# EAGLE design LoginNFC (EAGLE 7.5.0)
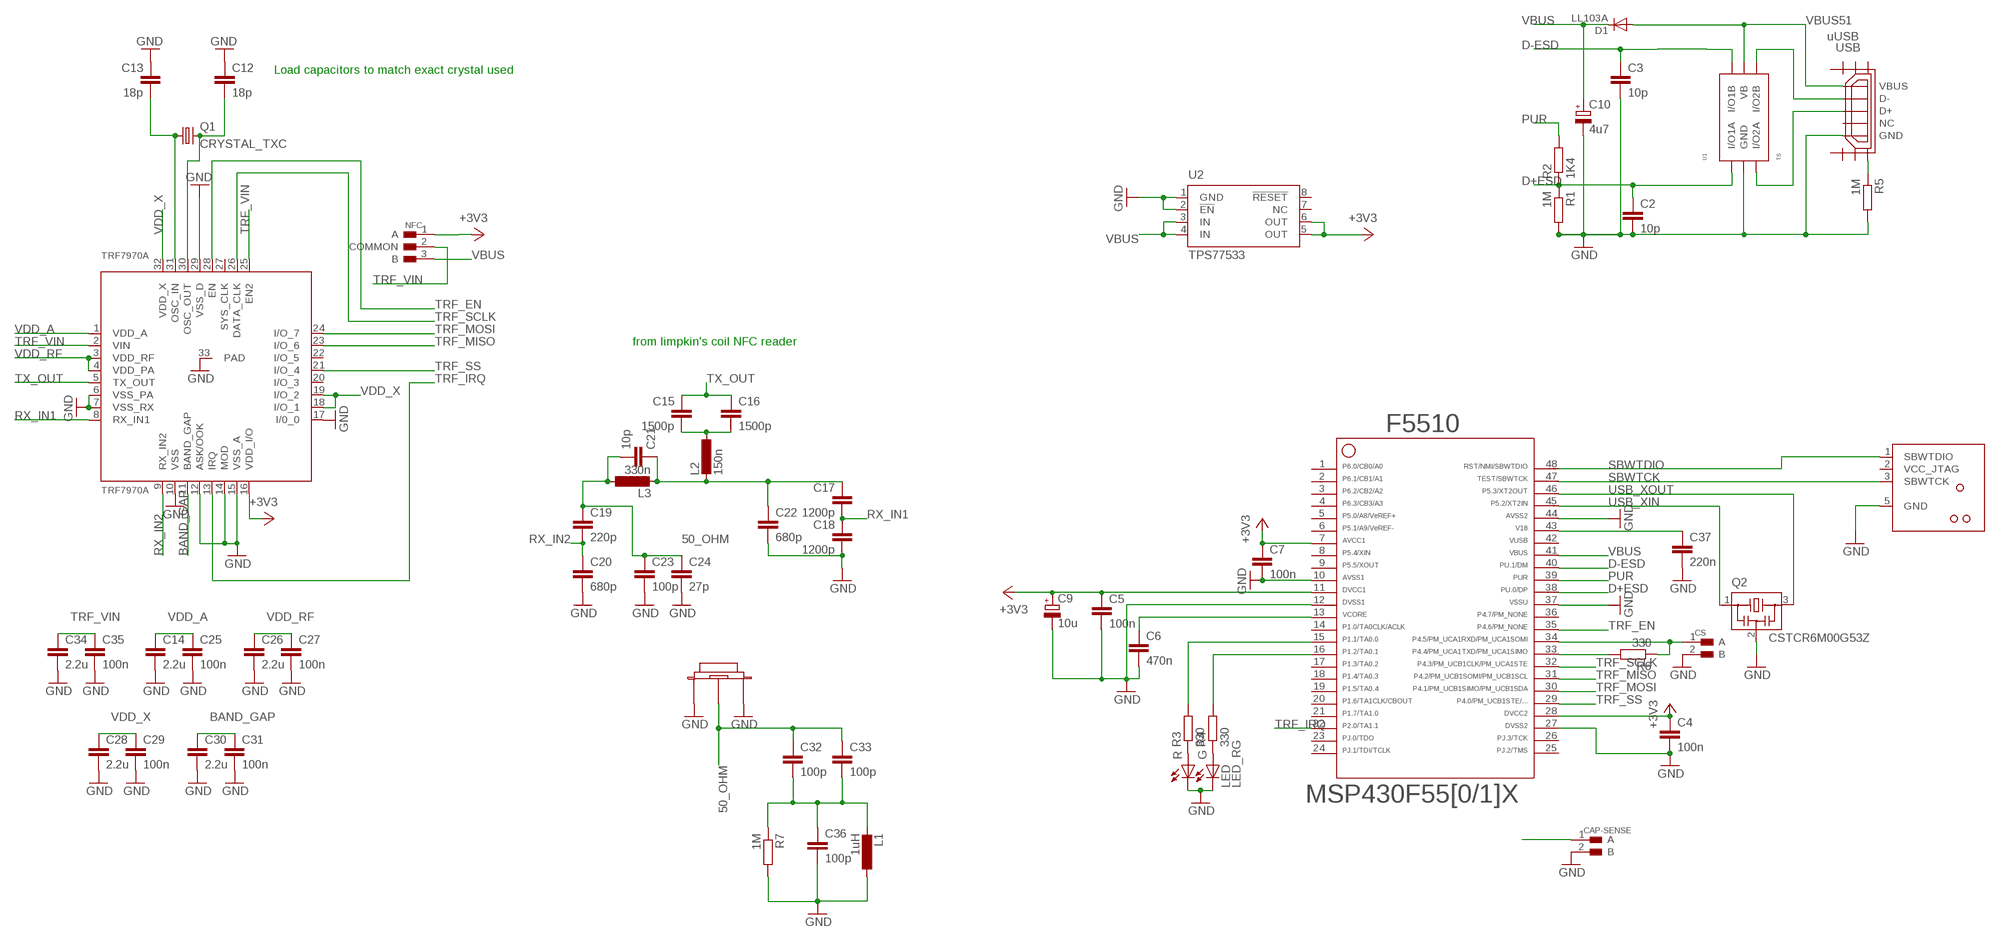
[diagram p0: schematic, sheet 1]

## Parts
C2  10p  C-EUC0805  [C0805]
C3  10p  C-EUC0805  [C0805]
C4  100n  C-EUC0805  [C0805]
C5  100n  C-EUC0805  [C0805]
C6  470n  C-EUC0805  [C0805]
C7  100n  C-EUC0805  [C0805]
C9  10u  CPOL-EUA/3216-18R  [A/3216-18R]
C10  4u7  CPOL-EUA/3216-18R  [A/3216-18R]
C12  18p  C-EU_C0805  [C0805]
C13  18p  C-EU_C0805  [C0805]
C14  2.2u  C-EU_C0805  [C0805]
C15  1500p  C-EUC0805  [C0805]
C16  1500p  C-EUC0805  [C0805]
C17  1200p  C-EUC0805  [C0805]
C18  1200p  C-EUC0805  [C0805]
C19  220p  C-EUC0805  [C0805]
C20  680p  C-EUC0805  [C0805]
C21  10p  C-EUC0805  [C0805]
C22  680p  C-EUC0805  [C0805]
C23  100p  C-EUC0805  [C0805]
C24  27p  C-EUC0805  [C0805]
C25  100n  C-EU_C0805  [C0805]
C26  2.2u  C-EU_C0805  [C0805]
C27  100n  C-EU_C0805  [C0805]
C28  2.2u  C-EU_C0805  [C0805]
C29  100n  C-EU_C0805  [C0805]
C30  2.2u  C-EU_C0805  [C0805]
C31  100n  C-EU_C0805  [C0805]
C32  100p  C-EUC0805  [C0805]
C33  100p  C-EUC0805  [C0805]
C34  2.2u  C-EU_C0805  [C0805]
C35  100n  C-EU_C0805  [C0805]
C36  100p  C-EUC0805  [C0805]
C37  220n  C-EUC0805  [C0805]
CAP-SENSE  PAD  [JUMP-2]
CS  PAD  [JUMP-2]
D1  LL103A  DIODE  [SOD-80]
F5510  F55[0/1]X---PT48  [PT48]
JTAG  TC2030-MSP430-NO-UART-NL  [TC2030-MSP430-NL-NO-UART]
L1  1uH  L-EU_MIDMOUNT  [RADIAL_MIDMOUNT_5]
L2  150n  L-EU_L1008  [L1008]
L3  330n  L-EU_L1008  [L1008]
LED  LED_RG  [1411]
NFC  JUMPER  [SMT-JUMPER]
Q1  CRYSTAL_TXC  [CRYSTAL_TCX]
Q2  CSTCR6M00G53Z  [CSTCR6M]
R1  1M  R-EU_R0805  [R0805]
R2  1K4  R-EU_R0805  [R0805]
R3  330  R-EU_R0805  [R0805]
R4  330  R-EU_R0805  [R0805]
R5  1M  R-EU_R0805  [R0805]
R6  330  R-EU_R0805  [R0805]
R7  1M  R-EU_R0805  [R0805]
TRF7970A  TRF7970A  [QFN(RHB)32]
U1  TS  IP4234CZ6SOT-457  [SOT-457]
U2  TPS77533  [SO08]
UFL1  U.FL  [U.FL]
USB  uUSB  USB_MICRO_FLIPPED  [HIROSE-ZX62R-B-5P]

## Nets
50_OHM: C19.1 C21.2 C23.1 C24.1 C32.1 C33.1 L3.1 UFL1.RF
+3V3: C4.1 C5.1 C7.1 C9.+ F5510.7 F5510.11 F5510.28 NFC.1(A) TRF7970A.16(VDD_I/O) U2.5(OUT) U2.6(OUT)
BAND_GAP: C30.1 C31.1 TRF7970A.11(BAND_GAP)
D+ESD: C2.1 F5510.38 R1.1 R2.1 U1.1(I/O1A)
D-ESD: C3.1 F5510.40 U1.6(I/O1B)
GND: C2.2 C3.2 C4.2 C5.2 C6.2 C7.2 C9.- C10.- C12.1 C13.1 C14.2 C18.2 C20.2 C22.2 C23.2 C24.2 C25.2 C26.2 C27.2 C28.2 C29.2 C30.2 C31.2 C34.2 C35.2 C36.2 C37.2 CAP-SENSE.2(B) CS.2(B) F5510.10 F5510.12 F5510.27 F5510.37 F5510.44 JTAG.5(GND) L1.P$1 LED.P$3(RED_C) LED.P$4(GREEN_C) Q2.2 R1.2 R5.2 R7.2 TRF7970A.6(VSS_PA) TRF7970A.7(VSS_RX) TRF7970A.10(VSS) TRF7970A.12(ASK/OOK) TRF7970A.14(MOD) TRF7970A.15(VSS_A) TRF7970A.17(I/0_0) TRF7970A.29(VSS_D) TRF7970A.33(PAD) U1.2(GND) U2.1(GND) U2.2(!EN) UFL1.GND1 UFL1.GND2 USB.GND
LED_G: F5510.16 R4.2
LED_R: F5510.15 R3.2
N$1: U1.3(I/O2A) USB.D+
N$2: U1.4(I/O2B) USB.D-
N$3: C6.1 F5510.13
N$4: LED.P$1(RED_A) R3.1
N$5: LED.P$2(GREEN_A) R4.1
N$6: C32.2 C33.2 C36.1 L1.P$2 R7.1
N$7: R5.1 USB.SHIELD3
N$8: C15.2 C16.2 L2.1
N$9: C17.1 C21.1 C22.1 L2.2 L3.2
N$10: CS.1(A) F5510.34 R6.1
N$12: C13.2 Q1.1 TRF7970A.31(OSC_IN)
N$13: C12.2 Q1.2 TRF7970A.30(OSC_OUT)
N$14: F5510.33 R6.2
N$16: CAP-SENSE.1(A)
PUR: F5510.39 R2.2
RX_IN1: C17.2 C18.1 TRF7970A.8(RX_IN1)
RX_IN2: C19.2 C20.1 TRF7970A.9(RX_IN2)
SBWTCK: F5510.47 JTAG.3(SBWTCK)
SBWTDIO: F5510.48 JTAG.1(SBWTDIO)
TRF_EN: F5510.35 TRF7970A.28(EN)
TRF_IRQ: F5510.22 TRF7970A.13(IRQ)
TRF_MISO: F5510.31 TRF7970A.23(I/O_6)
TRF_MOSI: F5510.30 TRF7970A.24(I/O_7)
TRF_SCLK: F5510.32 TRF7970A.26(DATA_CLK)
TRF_SS: F5510.29 TRF7970A.21(I/O_4)
TRF_VIN: C34.1 C35.1 NFC.2(COMMON) TRF7970A.2(VIN) TRF7970A.25(EN2)
TX_OUT: C15.1 C16.1 TRF7970A.5(TX_OUT)
USB_XIN: F5510.45 Q2.1
USB_XOUT: F5510.46 Q2.3
V18: C37.1 F5510.43
VBUS: C10.+ D1.2(K) F5510.41 NFC.3(B) U2.3(IN) U2.4(IN)
VBUS51: D1.1(A) U1.5(VB) USB.VBUS
VDD_A: C14.1 C25.1 TRF7970A.1(VDD_A)
VDD_RF: C26.1 C27.1 TRF7970A.3(VDD_RF) TRF7970A.4(VDD_PA)
VDD_X: C28.1 C29.1 TRF7970A.18(I/O_1) TRF7970A.19(I/O_2) TRF7970A.32(VDD_X)
Unconnected: F5510.1 F5510.2 F5510.3 F5510.4 F5510.5 F5510.6 F5510.8 F5510.9 F5510.14 F5510.17 F5510.18 F5510.19 F5510.20 F5510.21 F5510.23 F5510.24 F5510.25 F5510.26 F5510.36 TRF7970A.20(I/O_3) TRF7970A.22(I/O_5) TRF7970A.27(SYS_CLK) U2.7(NC) U2.8(!RESET) USB.NC USB.SHIELD1 USB.SHIELD2 USB.SHIELD4 USB.SHIELD5 USB.SHIELD6

## Notes on the sheet
- Load capacitors to match exact crystal used
- from limpkin's coil NFC reader

## Power pins joined to a net without a drawn wire
42: F5510.42
VCC_JTAG: JTAG.2(VCC_JTAG)

## Library data of the parts
C2-C7 C15-C24 C32 C33 C36 C37 = FredMiscellaneous:C-EU: CAPACITOR, European symbol
C9 C10 = rcl:CPOL-EU: POLARIZED CAPACITOR, European symbol
C12-C14 C25-C31 C34 C35 = FredMiscellaneous:C-EU_: CAPACITOR, European symbol
CAP-SENSE CS = 0xfred:PAD
D1 = 0xfred:DIODE
F5510 = TI_MSP430_v16:F55[0/1]X---PT48: ***F55[0/1/2]X*** PT48 Rev. 1.0 06/2010 "http://www.ti.com/lit/gpn/msp430f5509" Only for FF5504, F5508,F5509,F5510
JTAG = tag-connect:TC2030-MSP430-NO-UART
L1-L3 = FredMiscellaneous:L-EU_: INDUCTOR, European symbol
LED = 0xfred:LED_RG: Wurth bi-color LED 1411
NFC = FredMiscellaneous:JUMPER
Q1 = crystal_txc:CRYSTAL_TXC: TXC - 7A-16.000MAAJ-T - XTAL, 16.000MHZ, 18PF, SMD, 5.0X3.2
Q2 = murata-filter:CSTCR: Resonator Source: murata.co.jp; MPN: CSTCR6M00G53-R0; OC_FARNELL: 1170434; OC_NEWARK: 25M8759
R1-R7 = FredMiscellaneous:R-EU_: RESISTOR, European symbol
TRF7970A = FredMiscellaneous:TRF7970A: TRF7970ARHB
U1 = PP_Passives:IP4234CZ6: Mouser Part #: 771-IP4234CZ6125 Manufacturer Part #: IP4234CZ6,125 Manufacturer: NXP Semiconductors Description: ESD Suppressors Single USB 2.0 ESD Protection 6-Pin http://www.mouser.com/ProductDetail/NXP-Semiconductors/IP4234CZ6125/?qs=sGAEpiMZZMvxHShE6Whpu7QUdHOfUl1T0xbl582qhFk%3d
U2 = 0xfred:TPS77533
UFL1 = FredMiscellaneous:U.FL
USB = FredMiscellaneous:USB_MICRO_FLIPPED

## Board
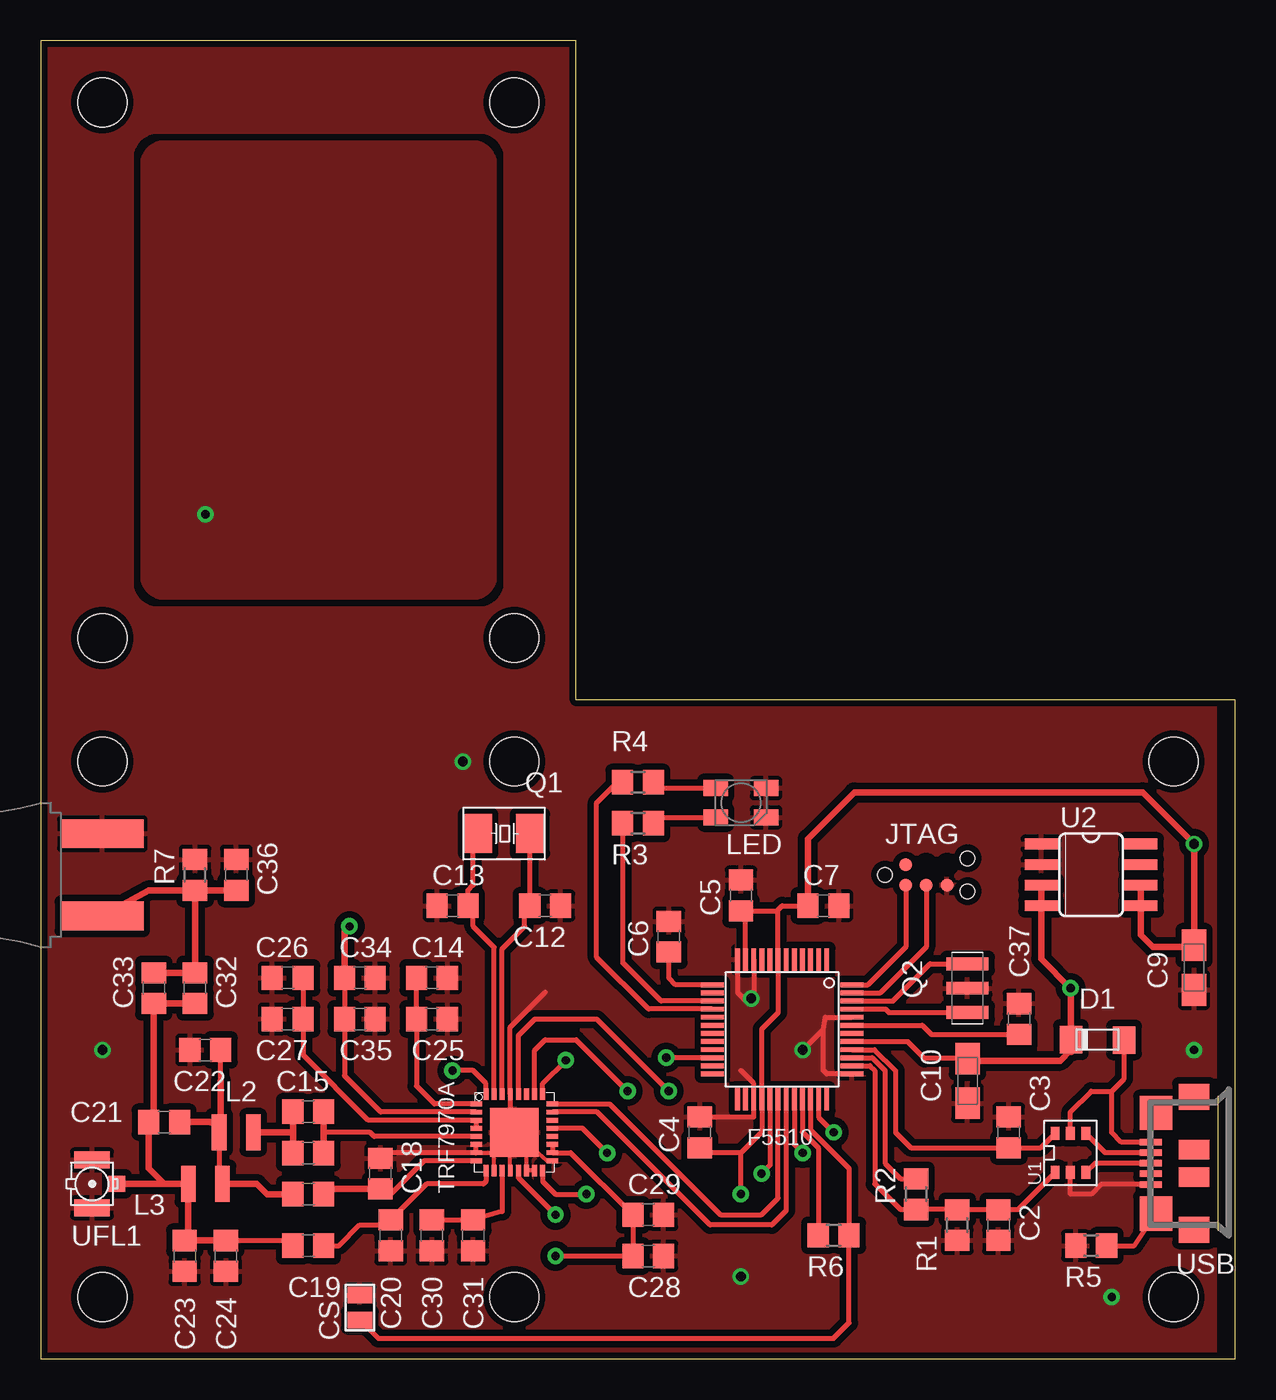
[diagram p1: board, top side]
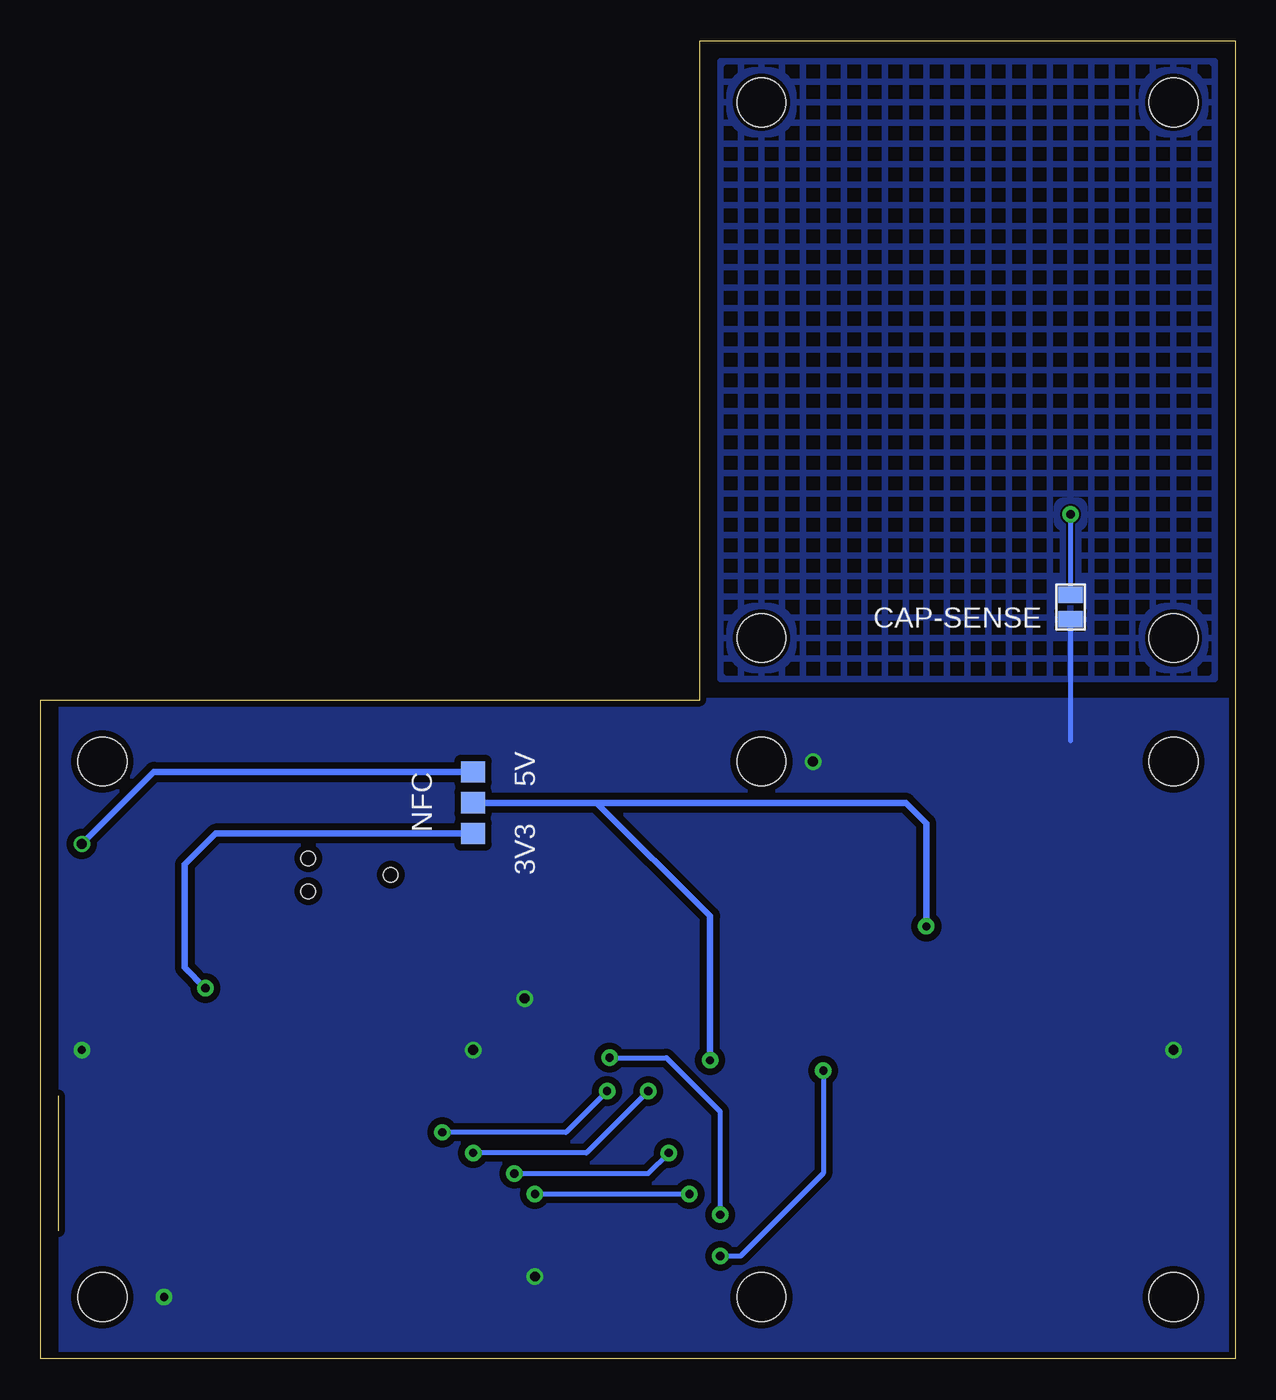
[diagram p2: board, bottom side, seen from below]

Size 73.66 x 81.28 mm. Coordinates in mm from the lower left corner, seen from the top.
Outline: 0,0 73.66,0 73.66,40.64 33.02,40.64 33.02,81.28 0,81.28 0,0
Copper layers (1*16): Top 0.035mm / dielectric 1.5mm / Bottom 0.035mm
Design rules "dirt_cheap_dirty_boards.v1": minimum track width 5mil, minimum drill 12mil, track to track 5mil, track to pad 5mil, pad to pad 5mil, via to via 5mil, smd to smd 0mil, copper to edge 10mil, drill to drill 10mil, minimum pad ring 10mil, minimum via ring 6mil, stop-mask expansion 2mil, vias tented up to drill 25mil, thermal gap 10mil
Holes 3 mm at 3.81,3.81 69.85,3.81 69.85,36.83 3.81,36.83 29.21,3.81 29.21,36.83 29.21,44.45 3.81,44.45 3.81,77.47 29.21,77.47

### Footprints (pad centres in the part's own frame; a part is rotated, then mirrored left to right if it is on the bottom)
C0805 = smd 1.3 x 1.5: 1 -0.95,0; 2 0.95,0
A/3216-18R = smd 1.95 x 1.5: + 1.375,0; - -1.375,0
JUMP-2 = smd 1.016 x 1.524: 1 -0.762,0; 2 0.762,0
SOD-80 = smd 1.397 x 1.702: 1 1.397,-0.025; 2 -1.88,0
PT48 = smd 1.4 x 0.3: 1 -4.3,2.75; 2 -4.3,2.25; 3 -4.3,1.75; 4 -4.3,1.25; 5 -4.3,0.75; 6 -4.3,0.25; 7 -4.3,-0.25; 8 -4.3,-0.75; 9 -4.3,-1.25; 10 -4.3,-1.75; 11 -4.3,-2.25; 12 -4.3,-2.75; 25 4.3,-2.75; 26 4.3,-2.25; 27 4.3,-1.75; 28 4.3,-1.25; 29 4.3,-0.75; 30 4.3,-0.25; 31 4.3,0.25; 32 4.3,0.75; 33 4.3,1.25; 34 4.3,1.75; 35 4.3,2.25; 36 4.3,2.75 | smd 0.3 x 1.4: 13 -2.75,-4.3; 14 -2.25,-4.3; 15 -1.75,-4.3; 16 -1.25,-4.3; 17 -0.75,-4.3; 18 -0.25,-4.3; 19 0.25,-4.3; 20 0.75,-4.3; 21 1.25,-4.3; 22 1.75,-4.3; 23 2.25,-4.3; 24 2.75,-4.3; 37 2.75,4.3; 38 2.25,4.3; 39 1.75,4.3; 40 1.25,4.3; 41 0.75,4.3; 42 0.25,4.3; 43 -0.25,4.3; 44 -0.75,4.3; 45 -1.25,4.3; 46 -1.75,4.3; 47 -2.25,4.3; 48 -2.75,4.3
TC2030-MSP430-NL-NO-UART = smd 0.787 x 0.787: 1 1.27,-0.635; 2 1.27,0.635; 3 2.54,-0.635; 5 3.81,-0.635 | hole 0.889: 0,0; 5.08,-1.016; 5.08,1.016
RADIAL_MIDMOUNT_5 = smd 5.08 x 1.778: P$1 2.54,2.54; P$2 2.54,-2.54
L1008 = smd 0.9 x 2.2: 1 -1.05,0; 2 1.05,0
1411 = smd 1.499 x 0.991: P$1 1.549,0.899; P$2 1.549,-0.899; P$3 -1.549,0.899; P$4 -1.549,-0.899
SMT-JUMPER = smd 1.3 x 1.5: 1 -1.903,0; 2 -0.003,0; 3 1.903,0
CRYSTAL_TCX = smd 1.7 x 2.4: 1 -1.6,0; 2 1.6,0
CSTCR6M = smd 0.8 x 2.6: 1 -1.5,0; 2 0,0; 3 1.5,0
R0805 = smd 1.3 x 1.5: 1 -0.95,0; 2 0.95,0
QFN(RHB)32 = smd 0.7 x 0.3: 1 -2.35,1.75; 2 -2.35,1.25; 3 -2.35,0.75; 4 -2.35,0.25; 5 -2.35,-0.25; 6 -2.35,-0.75; 7 -2.35,-1.25; 8 -2.35,-1.75; 17 2.35,-1.75; 18 2.35,-1.25; 19 2.35,-0.75; 20 2.35,-0.25; 21 2.35,0.25; 22 2.35,0.75; 23 2.35,1.25; 24 2.35,1.75 | smd 0.3 x 0.7: 9 -1.75,-2.35; 10 -1.25,-2.35; 11 -0.75,-2.35; 12 -0.25,-2.35; 13 0.25,-2.35; 14 0.75,-2.35; 15 1.25,-2.35; 16 1.75,-2.35; 25 1.75,2.35; 26 1.25,2.35; 27 0.75,2.35; 28 0.25,2.35; 29 -0.25,2.35; 30 -0.75,2.35; 31 -1.25,2.35; 32 -1.75,2.35 | smd 3 x 3: 33 0,0
SOT-457 = smd 0.8 x 0.55: 1 -1.2,0.95; 2 -1.2,0; 3 -1.2,-0.95; 4 1.2,-0.95; 5 1.2,0; 6 1.2,0.95
SO08 = smd 0.66 x 2.032: 1 -1.905,-3.073; 2 -0.635,-3.073; 3 0.635,-3.073; 4 1.905,-3.073; 5 1.905,3.073; 6 0.635,3.073; 7 -0.635,3.073; 8 -1.905,3.073
U.FL = smd 1.05 x 2.2: GND1 -1.475,0; GND2 1.475,0 | smd 1 x 1.05: RF 0,-1.525
HIROSE-ZX62R-B-5P = smd 1.35 x 0.4: D+ 2.675,0; D- 2.675,-0.65; GND 2.675,1.3; NC 2.675,0.65; VBUS 2.675,-1.3 | smd 1.9 x 1.6: SHIELD1 0,4.1; SHIELD2 0,-4.1 | smd 2 x 2.1: SHIELD3 2.35,3.1; SHIELD4 2.35,-3.1 | smd 1.9 x 1.2: SHIELD5 0,0.85; SHIELD6 0,-0.85

### Placement (x,y rotation side)
C2  59.05,8.26 270 top
C3  59.69,13.97 90 top
C4  40.64,13.97 90 top
C5  43.18,28.57 90 top
C6  38.73,26.04 90 top
C7  48.26,27.94 0 top
C9  71.12,24.13 90 top
C10  57.15,17.14 90 top
C12  31.11,27.94 180 top
C13  25.4,27.94 0 top
C14  24.13,23.5 0 top
C15  16.51,15.24 180 top
C16  16.51,12.7 180 top
C17  16.51,10.16 0 top
C18  20.95,11.43 90 top
C19  16.51,6.99 0 top
C20  21.59,7.62 270 top
C21  7.62,14.61 180 top
C22  10.16,19.05 180 top
C23  8.89,6.35 270 top
C24  11.43,6.35 270 top
C25  24.13,20.95 0 top
C26  15.24,23.5 180 top
C27  15.24,20.95 180 top
C28  37.47,6.35 0 top
C29  37.47,8.89 0 top
C30  24.13,7.62 270 top
C31  26.67,7.62 270 top
C32  9.53,22.86 90 top
C33  6.99,22.86 90 top
C34  19.68,23.5 0 top
C35  19.68,20.95 0 top
C36  12.06,29.84 90 top
C37  60.33,20.95 90 top
CAP-SENSE  10.16,46.35 270 bottom
CS  19.68,3.17 90 top
D1  65.41,19.68 0 top
F5510  45.72,20.32 270 top
JTAG  52.07,29.84 0 top
L1  1.27,29.84 0 top
L2  12.06,13.97 180 top
L3  10.16,10.79 0 top
LED  43.18,34.29 180 top
NFC  46.99,34.29 270 bottom
Q1  28.57,32.38 0 top
Q2  57.15,22.86 90 top
R1  56.52,8.26 270 top
R2  53.98,10.16 90 top
R3  36.83,33.02 180 top
R4  36.83,35.56 180 top
R5  64.77,6.99 180 top
R6  48.9,7.62 180 top
R7  9.53,29.84 90 top
TRF7970A  29.21,13.97 0 top
U1  63.5,12.7 90 top
U2  64.77,29.84 270 top
UFL1  3.17,10.79 90 top
USB  71.12,12.06 180 top

### Tracks (layer width: path | path; a pad name or v marks a point on that pad's centre or on a via)
50_OHM
  Top 0.305: 9.11,7.52 C23.1 | C24.1 15.24,7.3 C19.1
  Top 0.406: C24.1 C23.1 | 9.11,7.52 L3.1 7.62,10.79 | UFL1.RF 7.62,10.79 | 7.62,10.79 6.67,11.74 C21.2 6.99,14.92 C33.1 C32.1
+3V3  (via drill 0.51 pad 1.02, 0.6 pad 1.02)
  Top 0.305: 43.18,12.7 44.47,13.99 F5510.28 44.45,16.04 44.45,20.32 45.47,21.34 F5510.7 45.47,27.69 | 43.18,12.7 40.96,12.7 C4.1 | v43.18,10.16 43.18,12.7 | TRF7970A.16 30.96,10.95 31.75,10.16 v33.66,10.16 | 45.47,27.69 45.72,27.94 C7.1 | 45.47,27.69 45.41,27.62 C5.1 43.47,27.34 F5510.11
  Top 0.406: U2.6 U2.5 67.84,26.14 68.58,25.4 71.02,25.4 C9.+ v71.12,31.75 67.94,34.92 50.16,34.92 47.31,32.07 C7.1
  Bottom 0.305: v33.66,10.16 v43.18,10.16
  Bottom 0.406: v71.12,31.75 66.67,36.2 NFC.1
BAND_GAP
  Top 0.305: TRF7970A.11 28.46,9.09 C31.1 C30.1
CAP_SENSE  (via drill 0.51 pad 1.02)
  Bottom 0.305: v10.16,52.07 10.16,46.99
  pour Top: 26.67,46.99 7.62,46.99 arc-90 6.35,48.26 6.35,73.66 arc-90 7.62,74.93 26.67,74.93 arc-90 27.94,73.66 27.94,48.26 arc-90
D+ESD
  Top 0.305: F5510.38 51.15,18.07 51.44,17.78 51.44,10.79 53.02,9.21 R2.1 57.15,9.21 R1.1 C2.1 60.26,9.21 U1.1
D-ESD
  Top 0.305: F5510.40 51.41,19.07 52.7,17.78 52.7,13.97 53.66,13.02 C3.1 61.67,13.02 U1.6
GND  (via drill 0.51 pad 1.02, 0.6 pad 1.02)
  Top 0.254: TRF7970A.12 28.96,13.72 TRF7970A.33 | TRF7970A.10 27.96,12.72 | TRF7970A.7 27.96,12.72 | 27.96,12.72 TRF7970A.33 | TRF7970A.33 29.96,13.22 TRF7970A.14 TRF7970A.15 | TRF7970A.17 31.21,12.22 TRF7970A.33
  Top 0.305: F5510.37 48.47,17.57 48.26,17.78 48.26,20.32 | 48.26,20.32 48.38,21.07 F5510.44 | F5510.12 42.97,22.59 43.58,21.98 v43.81,22.23 43.97,22.38 F5510.10 | TRF7970A.7 26.84,12.7 | 20.66,12.72 C18.2 21.3,12.72 TRF7970A.7 | TRF7970A.7 TRF7970A.6 | C4.2 43.97,14.92 F5510.27 43.97,16.99 43.18,17.78 | 31.11,22.61 28.96,20.45 TRF7970A.29 28.96,14.22 TRF7970A.33 | 48.26,20.32 v46.99,19.05 | USB.GND 65.38,10.77 64.77,10.16 63.5,10.16 U1.2
  Bottom 0.305: CAP-SENSE.2 10.16,38.1
  other vias: 66.04,3.81 71.12,19.05 26.04,36.83 3.81,19.05 43.18,5.08
  pour Top (isolate 0.406, rank 2): 0,0 72.39,0 72.39,40.64 33.02,40.64 33.02,81.28 0,81.28
  pour Bottom (isolate 0.406): 0,0 72.39,0 72.39,40.64 0,40.64
  pour Bottom (hatched): 1.27,80.01 31.75,80.01 31.75,41.91 1.27,41.91
LED_G
  Top 0.305: F5510.16 37.48,21.57 34.29,24.77 34.29,34.29 35.56,35.56 R4.2
LED_R
  Top 0.305: F5510.15 38.26,22.07 35.88,24.45 R3.2
N$1
  Top 0.305: USB.D+ 65.02,12.06 U1.3
N$2
  Top 0.305: USB.D- 65.64,12.71 U1.4
N$3
  Top 0.305: F5510.13 39.16,23.07 38.73,23.5 C6.1
N$4
  Top 0.305: R3.1 38.15,33.39 LED.P$1
N$5
  Top 0.305: R4.1 38.15,35.19 LED.P$2
N$6
  Top 0.305: R7.1 11.43,28.89
  Top 0.406: C33.2 C32.2 9.53,28.26 10.16,28.89 11.43,28.89 C36.1 | R7.1 6.67,28.89 L1.P$2
N$7
  Top 0.305: R5.1 67.42,6.99 USB.SHIELD3
N$8
  Top 0.406: C15.2 15.56,13.97 | 15.56,13.97 C16.2 | L2.1 15.56,13.97
N$9
  Top 0.305: L2.2 11.02,10.99 L3.2 | 10.7,13.65 L2.2 | 11.11,17.14 C22.1 | 11.11,14.06 L2.2
  Top 0.406: L3.2 13.34,10.79 13.97,10.16 C17.1 | 11.11,17.14 11.11,14.06 | C21.1 10.38,14.61 arc-90 L2.2
N$10
  Top 0.305: F5510.34 47.47,14.12 49.84,11.75 R6.1 49.84,2.22 48.9,1.27 20.83,1.27 CS.1
N$12
  Top 0.305: TRF7970A.31 27.96,25.38 26.67,26.67 26.67,27.62 C13.2 26.35,28.89 26.67,29.21 26.67,31.45 Q1.1
N$13
  Top 0.305: TRF7970A.30 28.46,25.29 29.84,26.67 29.84,27.62 C12.2 30.16,31.74 Q1.2
N$14
  Top 0.305: F5510.33 46.97,13.99 47.95,13.02 R6.2
PUR
  Top 0.305: F5510.39 51.28,18.57 52.07,17.78 52.07,12.06 53.02,11.11 R2.2
RX_IN1
  Top 0.305: C17.2 17.78,10.48 | TRF7970A.8 23.65,12.22 21.59,10.16 21.27,10.16 C18.1
  Top 0.406: 17.78,10.48 C18.1
RX_IN2
  Top 0.305: TRF7970A.9 27.46,10.95 27.3,10.79 23.82,10.79 C20.1 21.27,8.26 19.68,8.26 18.41,6.99 C19.2
SBWTCK
  Top 0.305: F5510.47 51.78,22.57 54.61,25.4 JTAG.3
SBWTDIO
  Top 0.305: F5510.48 51.01,23.07 53.34,25.4 JTAG.1
TRF_EN  (via drill 0.51 pad 1.02)
  Top 0.305: TRF7970A.28 29.46,19.93 30.48,20.95 34.29,20.95 v38.73,16.51 | F5510.35 47.97,14.89 v48.9,13.97
  Bottom 0.305: v38.73,16.51 41.27,13.97 v48.9,13.97
TRF_IRQ  (via drill 0.51 pad 1.02)
  Top 0.305: F5510.22 v38.58,18.57 | TRF7970A.13 29.46,11.18 v31.75,8.89
  Bottom 0.305: v31.75,8.89 31.75,15.24 35.08,18.57 v38.58,18.57
TRF_MISO
  Top 0.305: F5510.31 45.97,9.14 45.09,8.26 41.27,8.26 34.31,15.22 TRF7970A.23
TRF_MOSI
  Top 0.305: TRF7970A.24 35.08,15.72 41.91,8.89 44.45,8.89 45.47,9.91 F5510.30
TRF_SCLK  (via drill 0.51 pad 1.02)
  Top 0.305: TRF7970A.26 30.46,19.03 31.11,19.68 33.02,19.68 v36.2,16.51 | F5510.32 46.47,13.22 v46.99,12.7
  Bottom 0.305: v36.2,16.51 40.01,12.7 v46.99,12.7
TRF_SS  (via drill 0.51 pad 1.02)
  Top 0.305: v34.92,12.7 33.41,14.22 TRF7970A.21 | F5510.29 44.97,11.95 v44.45,11.43
  Bottom 0.305: v44.45,11.43 36.2,11.43 v34.92,12.7
TRF_VIN  (via drill 0.51 pad 1.02)
  Top 0.305: TRF7970A.2 20.98,15.22 18.73,17.46 C35.1 C34.1 | TRF7970A.25 30.96,16.99 v32.38,18.41
  Top 0.406: C34.1 18.73,26.36 v19.05,26.67
  Bottom 0.406: v32.38,18.41 32.38,27.3 39.37,34.29 | 39.37,34.29 NFC.2 | v19.05,26.67 19.05,33.02 20.32,34.29 39.37,34.29
TX_OUT
  Top 0.305: 17.46,13.97 20.32,13.97 20.57,13.72 TRF7970A.5
  Top 0.406: 17.78,15.24 C15.1 17.46,13.97 C16.1
USB_XIN
  Top 0.305: F5510.45 52.09,21.57 52.3,21.36 Q2.1
USB_XOUT
  Top 0.305: F5510.46 52.55,22.07 54.84,24.36 Q2.3
V18
  Top 0.305: F5510.43 54.36,20.57 54.92,20 C37.1
VBUS  (via drill 0.51 pad 1.02)
  Top 0.305: F5510.41 53.45,19.57 54.51,18.52 C10.+ 57.05,17.78
  Top 0.406: U2.4 U2.3 61.7,24.66 v63.5,22.86 63.52,22.84 D1.2 | 57.15,18.39 62.86,18.39 63.52,19.05
  Top 0.61: D1.2 63.52,19.05 | 57.15,18.39 C10.+
  Bottom 0.406: NFC.3 62.86,32.39 64.77,30.48 64.77,24.13 v63.5,22.86
VBUS51
  Top 0.305: USB.VBUS 66.64,13.37 66.04,13.97 66.04,16.51 | U1.5 63.5,15.24 64.77,16.51 66.04,16.51 | 66.04,16.51 66.8,17.27 D1.1
VDD_A
  Top 0.305: C14.1 C25.1 23.18,16.82 24.29,15.72 TRF7970A.1
VDD_RF
  Top 0.305: C26.1 C27.1 16.19,18.73 20.2,14.72 TRF7970A.3 TRF7970A.4
VDD_X  (via drill 0.51 pad 1.02)
  Top 0.305: TRF7970A.19 TRF7970A.18 32.69,12.72 C29.1 C28.1 v31.75,6.35 | TRF7970A.32 27.46,16.99 26.67,17.78 v25.4,17.78
  Bottom 0.305: v25.4,17.78 25.4,11.43 30.48,6.35 v31.75,6.35

### Text on the board
bNames: 5V | 3V3
tStop: LoginNFC 2.1 / 0xFRED 2015 | LoginNFC 2.1 / 0xFRED 2015
tSilk: LoginNFC v2.0 / 0xFRED 2015